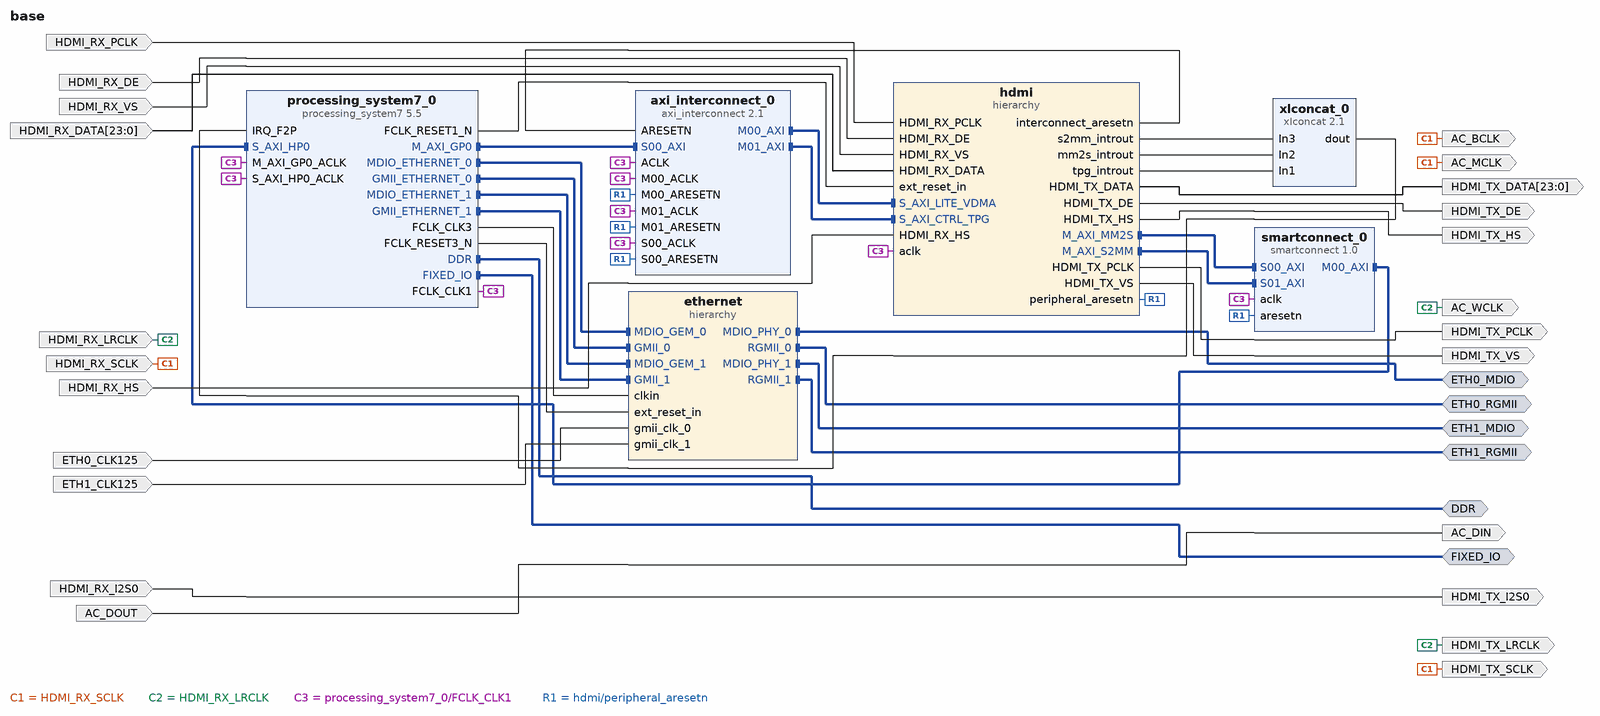
[diagram p0: block diagram of the top level]
# Vivado block design base, xc7z020clg400-3, Vivado 2018.2
create_bd_design base

create_bd_intf_port -mode Master -vlnv xilinx.com:interface:ddrx_rtl:1.0 DDR
create_bd_intf_port -mode Master -vlnv xilinx.com:display_processing_system7:fixedio_rtl:1.0 FIXED_IO
create_bd_intf_port -mode Master -vlnv xilinx.com:interface:mdio_rtl:1.0 ETH0_MDIO
create_bd_intf_port -mode Master -vlnv xilinx.com:interface:rgmii_rtl:1.0 ETH0_RGMII
create_bd_intf_port -mode Master -vlnv xilinx.com:interface:mdio_rtl:1.0 ETH1_MDIO
create_bd_intf_port -mode Master -vlnv xilinx.com:interface:rgmii_rtl:1.0 ETH1_RGMII
create_bd_port -dir I -type clk HDMI_RX_PCLK
set_property -dict {CONFIG.FREQ_HZ 74250000} [get_bd_ports HDMI_RX_PCLK]
create_bd_port -dir I HDMI_RX_SCLK
create_bd_port -dir O HDMI_TX_SCLK
create_bd_port -dir O AC_MCLK
create_bd_port -dir O -type clk AC_BCLK
create_bd_port -dir I HDMI_RX_LRCLK
create_bd_port -dir O HDMI_TX_LRCLK
create_bd_port -dir O AC_WCLK
create_bd_port -dir I HDMI_RX_I2S0
create_bd_port -dir O -type data HDMI_TX_I2S0
create_bd_port -dir I -type data AC_DOUT
create_bd_port -dir O -type data AC_DIN
create_bd_port -dir O -from 23 -to 0 HDMI_TX_DATA
create_bd_port -dir O HDMI_TX_DE
create_bd_port -dir O HDMI_TX_HS
create_bd_port -dir O HDMI_TX_VS
create_bd_port -dir I HDMI_RX_DE
create_bd_port -dir I HDMI_RX_VS
create_bd_port -dir I -from 23 -to 0 -type data HDMI_RX_DATA
create_bd_port -dir I HDMI_RX_HS
create_bd_port -dir I -type clk ETH0_CLK125
set_property -dict {CONFIG.FREQ_HZ 125000000} [get_bd_ports ETH0_CLK125]
create_bd_port -dir I -type clk ETH1_CLK125
set_property -dict {CONFIG.FREQ_HZ 125000000} [get_bd_ports ETH1_CLK125]
create_bd_port -dir O -type clk HDMI_TX_PCLK

create_bd_cell -type ip -vlnv xilinx.com:ip:xlconcat:2.1 xlconcat_0
set_property -dict {CONFIG.NUM_PORTS 4 CONFIG.IN0_WIDTH 13} [get_bd_cells xlconcat_0]
create_bd_cell -type ip -vlnv xilinx.com:ip:processing_system7:5.5 processing_system7_0
set_property -dict [list \
  CONFIG.PCW_UIPARAM_DDR_FREQ_MHZ 400 \
  CONFIG.PCW_CPU_CPU_6X4X_MAX_RANGE 867 \
  CONFIG.PCW_CRYSTAL_PERIPHERAL_FREQMHZ 33.333 \
  CONFIG.PCW_APU_PERIPHERAL_FREQMHZ 867 \
  CONFIG.PCW_SDIO_PERIPHERAL_FREQMHZ 100 \
  CONFIG.PCW_UART_PERIPHERAL_FREQMHZ 50 \
  CONFIG.PCW_I2C_PERIPHERAL_FREQMHZ 144.442993 \
  CONFIG.PCW_FPGA0_PERIPHERAL_FREQMHZ 50 \
  CONFIG.PCW_FPGA1_PERIPHERAL_FREQMHZ 100 \
  CONFIG.PCW_FPGA2_PERIPHERAL_FREQMHZ 150 \
  CONFIG.PCW_FPGA3_PERIPHERAL_FREQMHZ 200 \
  CONFIG.PCW_USE_S_AXI_HP0 1 \
  CONFIG.PCW_USE_FABRIC_INTERRUPT 1 \
  CONFIG.PCW_S_AXI_HP0_DATA_WIDTH 32 \
  CONFIG.PCW_EN_CLK1_PORT 1 \
  CONFIG.PCW_EN_CLK2_PORT 1 \
  CONFIG.PCW_EN_CLK3_PORT 1 \
  CONFIG.PCW_EN_RST1_PORT 1 \
  CONFIG.PCW_EN_RST2_PORT 1 \
  CONFIG.PCW_EN_RST3_PORT 1 \
  CONFIG.PCW_IRQ_F2P_INTR 1 \
  CONFIG.PCW_PERIPHERAL_BOARD_PRESET part0 \
  CONFIG.PCW_PRESET_BANK0_VOLTAGE {LVCMOS 1.8V} \
  CONFIG.PCW_PRESET_BANK1_VOLTAGE {LVCMOS 1.8V} \
  CONFIG.PCW_UIPARAM_DDR_MEMORY_TYPE {LPDDR 2} \
  CONFIG.PCW_UIPARAM_DDR_PARTNO Custom \
  CONFIG.PCW_QSPI_PERIPHERAL_ENABLE 1 \
  CONFIG.PCW_QSPI_QSPI_IO {MIO 1 .. 6} \
  CONFIG.PCW_QSPI_GRP_SINGLE_SS_ENABLE 1 \
  CONFIG.PCW_QSPI_GRP_SINGLE_SS_IO {MIO 1 .. 6} \
  CONFIG.PCW_SINGLE_QSPI_DATA_MODE x4 \
  CONFIG.PCW_QSPI_GRP_FBCLK_ENABLE 1 \
  CONFIG.PCW_QSPI_GRP_FBCLK_IO {MIO 8} \
  CONFIG.PCW_ENET0_PERIPHERAL_ENABLE 1 \
  CONFIG.PCW_ENET0_ENET0_IO EMIO \
  CONFIG.PCW_ENET0_GRP_MDIO_ENABLE 1 \
  CONFIG.PCW_ENET0_GRP_MDIO_IO EMIO \
  CONFIG.PCW_ENET_RESET_ENABLE 1 \
  CONFIG.PCW_ENET_RESET_SELECT {Share reset pin} \
  CONFIG.PCW_ENET0_RESET_ENABLE 0 \
  CONFIG.PCW_ENET1_PERIPHERAL_ENABLE 1 \
  CONFIG.PCW_ENET1_ENET1_IO EMIO \
  CONFIG.PCW_ENET1_GRP_MDIO_ENABLE 1 \
  CONFIG.PCW_ENET1_GRP_MDIO_IO EMIO \
  CONFIG.PCW_SD0_PERIPHERAL_ENABLE 1 \
  CONFIG.PCW_SD0_SD0_IO {MIO 40 .. 45} \
  CONFIG.PCW_SD0_GRP_CD_ENABLE 0 \
  CONFIG.PCW_SD0_GRP_WP_ENABLE 0 \
  CONFIG.PCW_SD1_PERIPHERAL_ENABLE 1 \
  CONFIG.PCW_SD1_SD1_IO {MIO 10 .. 15} \
  CONFIG.PCW_UART0_PERIPHERAL_ENABLE 1 \
  CONFIG.PCW_UART0_UART0_IO {MIO 50 .. 51} \
  CONFIG.PCW_UART1_PERIPHERAL_ENABLE 0 \
  CONFIG.PCW_SPI1_PERIPHERAL_ENABLE 1 \
  CONFIG.PCW_SPI1_SPI1_IO {MIO 46 .. 51} \
  CONFIG.PCW_USB0_PERIPHERAL_ENABLE 1 \
  CONFIG.PCW_USB0_USB0_IO {MIO 28 .. 39} \
  CONFIG.PCW_USB_RESET_ENABLE 1 \
  CONFIG.PCW_USB_RESET_SELECT {Share reset pin} \
  CONFIG.PCW_USB0_RESET_ENABLE 0 \
  CONFIG.PCW_I2C1_PERIPHERAL_ENABLE 1 \
  CONFIG.PCW_I2C1_I2C1_IO {MIO 24 .. 25} \
  CONFIG.PCW_I2C_RESET_ENABLE 1 \
  CONFIG.PCW_I2C_RESET_SELECT {Share reset pin} \
  CONFIG.PCW_GPIO_PERIPHERAL_ENABLE 1 \
  CONFIG.PCW_GPIO_MIO_GPIO_ENABLE 1 \
  CONFIG.PCW_GPIO_MIO_GPIO_IO MIO \
  CONFIG.PCW_GPIO_EMIO_GPIO_ENABLE 1 \
  CONFIG.PCW_GPIO_EMIO_GPIO_IO 64 \
  CONFIG.PCW_FPGA_FCLK1_ENABLE 1 \
  CONFIG.PCW_FPGA_FCLK2_ENABLE 1 \
  CONFIG.PCW_FPGA_FCLK3_ENABLE 1 \
] [get_bd_cells processing_system7_0]
# 527 more settings of processing_system7_0 are not shown: defaults, MIO pin electricals, DDR timing, and values the tool derives
create_bd_cell -type hier hdmi
create_bd_cell -type hier ethernet
create_bd_cell -type ip -vlnv xilinx.com:ip:axi_interconnect:2.1 axi_interconnect_0
set_property -dict {CONFIG.NUM_MI 2} [get_bd_cells axi_interconnect_0]
create_bd_cell -type ip -vlnv xilinx.com:ip:smartconnect:1.0 smartconnect_0

# ---- hierarchy /hdmi ----
current_bd_instance /hdmi
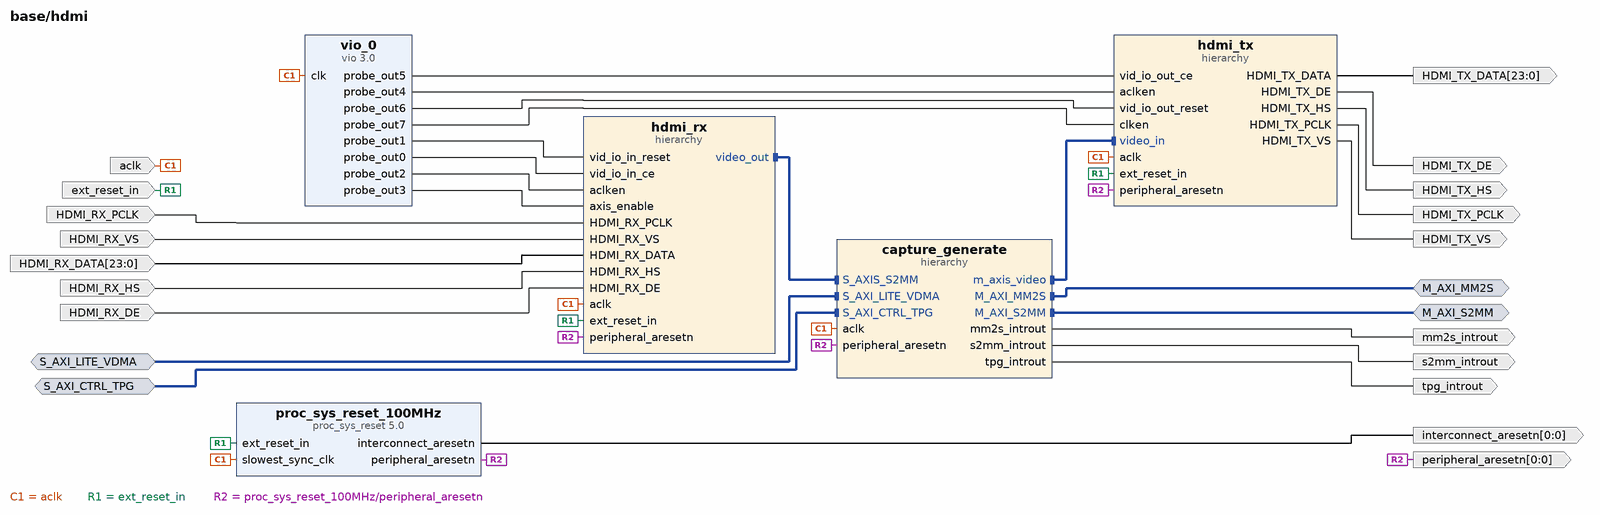
[diagram p1: block diagram inside /hdmi]
create_bd_intf_pin -mode Slave -vlnv xilinx.com:interface:aximm_rtl:1.0 S_AXI_LITE_VDMA
create_bd_intf_pin -mode Master -vlnv xilinx.com:interface:aximm_rtl:1.0 M_AXI_MM2S
create_bd_intf_pin -mode Master -vlnv xilinx.com:interface:aximm_rtl:1.0 M_AXI_S2MM
create_bd_intf_pin -mode Slave -vlnv xilinx.com:interface:aximm_rtl:1.0 S_AXI_CTRL_TPG
create_bd_pin -dir I -type clk aclk
create_bd_pin -dir I -type rst ext_reset_in
create_bd_pin -dir I -type clk HDMI_RX_PCLK
create_bd_pin -dir O -from 23 -to 0 HDMI_TX_DATA
create_bd_pin -dir O HDMI_TX_DE
create_bd_pin -dir O HDMI_TX_HS
create_bd_pin -dir O HDMI_TX_VS
create_bd_pin -dir I HDMI_RX_DE
create_bd_pin -dir I HDMI_RX_VS
create_bd_pin -dir I -from 23 -to 0 HDMI_RX_DATA
create_bd_pin -dir I HDMI_RX_HS
create_bd_pin -dir O -from 0 -to 0 -type rst peripheral_aresetn
create_bd_pin -dir O -from 0 -to 0 -type rst interconnect_aresetn
create_bd_pin -dir O -type intr mm2s_introut
create_bd_pin -dir O -type intr s2mm_introut
create_bd_pin -dir O HDMI_TX_PCLK
create_bd_pin -dir O -type intr tpg_introut

create_bd_cell -type ip -vlnv xilinx.com:ip:proc_sys_reset:5.0 proc_sys_reset_100MHz
create_bd_cell -type hier hdmi_rx
create_bd_cell -type hier hdmi_tx
create_bd_cell -type hier capture_generate
create_bd_cell -type ip -vlnv xilinx.com:ip:vio:3.0 vio_0
set_property -dict [list \
  CONFIG.C_PROBE_OUT7_INIT_VAL 0x1 \
  CONFIG.C_PROBE_OUT5_INIT_VAL 0x1 \
  CONFIG.C_PROBE_OUT4_INIT_VAL 0x1 \
  CONFIG.C_PROBE_OUT3_INIT_VAL 0x1 \
  CONFIG.C_PROBE_OUT2_INIT_VAL 0x1 \
  CONFIG.C_PROBE_OUT0_INIT_VAL 0x1 \
  CONFIG.C_NUM_PROBE_OUT 8 \
  CONFIG.C_NUM_PROBE_IN 0 \
] [get_bd_cells vio_0]

# ---- hierarchy /hdmi/hdmi_rx ----
current_bd_instance /hdmi/hdmi_rx
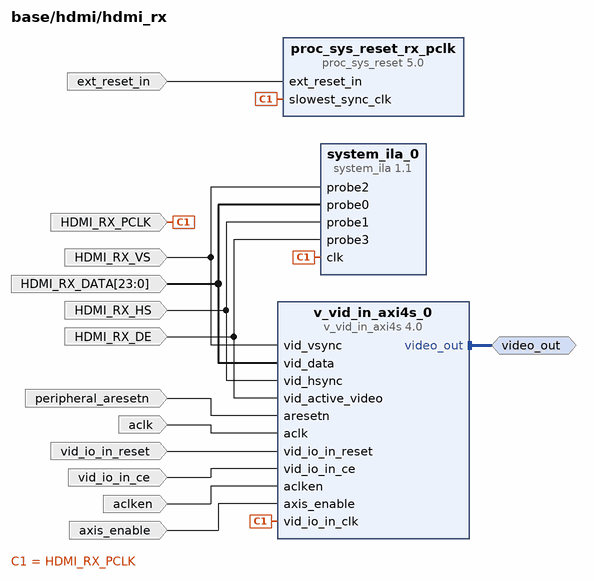
[diagram p2: block diagram inside /hdmi/hdmi_rx]
create_bd_intf_pin -mode Master -vlnv xilinx.com:interface:axis_rtl:1.0 video_out
create_bd_pin -dir I -type rst peripheral_aresetn
create_bd_pin -dir I HDMI_RX_VS
create_bd_pin -dir I -from 23 -to 0 HDMI_RX_DATA
create_bd_pin -dir I HDMI_RX_HS
create_bd_pin -dir I -type clk HDMI_RX_PCLK
create_bd_pin -dir I HDMI_RX_DE
create_bd_pin -dir I -type clk aclk
create_bd_pin -dir I -type rst vid_io_in_reset
create_bd_pin -dir I -type ce vid_io_in_ce
create_bd_pin -dir I -type ce aclken
create_bd_pin -dir I axis_enable
create_bd_pin -dir I -type rst ext_reset_in

create_bd_cell -type ip -vlnv xilinx.com:ip:v_vid_in_axi4s:4.0 v_vid_in_axi4s_0
set_property -dict {CONFIG.C_HAS_ASYNC_CLK 1 CONFIG.C_ADDR_WIDTH 12} [get_bd_cells v_vid_in_axi4s_0]
create_bd_cell -type ip -vlnv xilinx.com:ip:proc_sys_reset:5.0 proc_sys_reset_rx_pclk
create_bd_cell -type ip -vlnv xilinx.com:ip:system_ila:1.1 system_ila_0
set_property -dict [list \
  CONFIG.C_PROBE0_TYPE 1 \
  CONFIG.C_PROBE0_WIDTH 24 \
  CONFIG.C_DATA_DEPTH 4096 \
  CONFIG.C_NUM_OF_PROBES 4 \
  CONFIG.C_MON_TYPE NATIVE \
  CONFIG.C_PROBE_WIDTH_PROPAGATION MANUAL \
] [get_bd_cells system_ila_0]

# ---- hierarchy /hdmi/hdmi_tx ----
current_bd_instance /hdmi/hdmi_tx
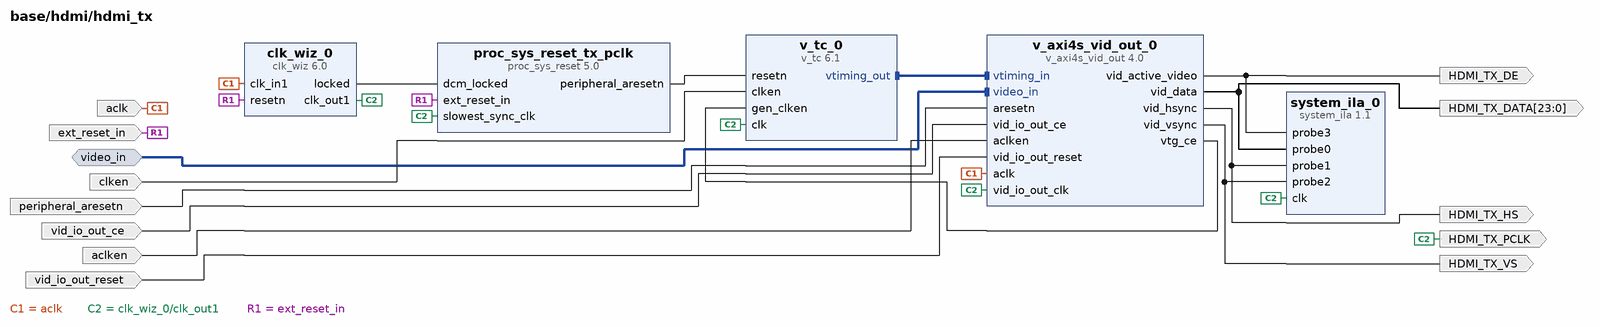
[diagram p3: block diagram inside /hdmi/hdmi_tx]
create_bd_intf_pin -mode Slave -vlnv xilinx.com:interface:axis_rtl:1.0 video_in
create_bd_pin -dir I -type rst peripheral_aresetn
create_bd_pin -dir O HDMI_TX_DE
create_bd_pin -dir O HDMI_TX_HS
create_bd_pin -dir O HDMI_TX_VS
create_bd_pin -dir O -from 23 -to 0 HDMI_TX_DATA
create_bd_pin -dir I -type clk aclk
create_bd_pin -dir I -type ce vid_io_out_ce
create_bd_pin -dir I -type ce aclken
create_bd_pin -dir I -type rst vid_io_out_reset
create_bd_pin -dir I -type ce clken
create_bd_pin -dir I -type rst ext_reset_in
create_bd_pin -dir O -type clk HDMI_TX_PCLK

create_bd_cell -type ip -vlnv xilinx.com:ip:v_axi4s_vid_out:4.0 v_axi4s_vid_out_0
set_property -dict {CONFIG.C_HAS_ASYNC_CLK 1 CONFIG.C_ADDR_WIDTH 5 CONFIG.C_VTG_MASTER_SLAVE 0} [get_bd_cells v_axi4s_vid_out_0]
create_bd_cell -type ip -vlnv xilinx.com:ip:v_tc:6.1 v_tc_0
set_property -dict [list \
  CONFIG.HAS_AXI4_LITE false \
  CONFIG.enable_detection false \
  CONFIG.vertical_blank_generation true \
  CONFIG.horizontal_blank_generation true \
] [get_bd_cells v_tc_0]
create_bd_cell -type ip -vlnv xilinx.com:ip:proc_sys_reset:5.0 proc_sys_reset_tx_pclk
create_bd_cell -type ip -vlnv xilinx.com:ip:clk_wiz:6.0 clk_wiz_0
set_property -dict [list \
  CONFIG.CLKOUT1_REQUESTED_OUT_FREQ 74.25 \
  CONFIG.PRIM_SOURCE No_buffer \
  CONFIG.RESET_PORT resetn \
  CONFIG.MMCM_DIVCLK_DIVIDE 2 \
  CONFIG.MMCM_CLKFBOUT_MULT_F 24.875 \
  CONFIG.MMCM_CLKOUT0_DIVIDE_F 16.750 \
  CONFIG.RESET_TYPE ACTIVE_LOW \
  CONFIG.CLKOUT1_JITTER 138.109 \
  CONFIG.CLKOUT1_PHASE_ERROR 148.904 \
] [get_bd_cells clk_wiz_0]
create_bd_cell -type ip -vlnv xilinx.com:ip:system_ila:1.1 system_ila_0
set_property -dict [list \
  CONFIG.C_PROBE0_TYPE 1 \
  CONFIG.C_PROBE0_WIDTH 24 \
  CONFIG.C_DATA_DEPTH 4096 \
  CONFIG.C_NUM_OF_PROBES 4 \
  CONFIG.C_MON_TYPE NATIVE \
  CONFIG.C_PROBE_WIDTH_PROPAGATION MANUAL \
] [get_bd_cells system_ila_0]

# ---- hierarchy /hdmi/capture_generate ----
current_bd_instance /hdmi/capture_generate
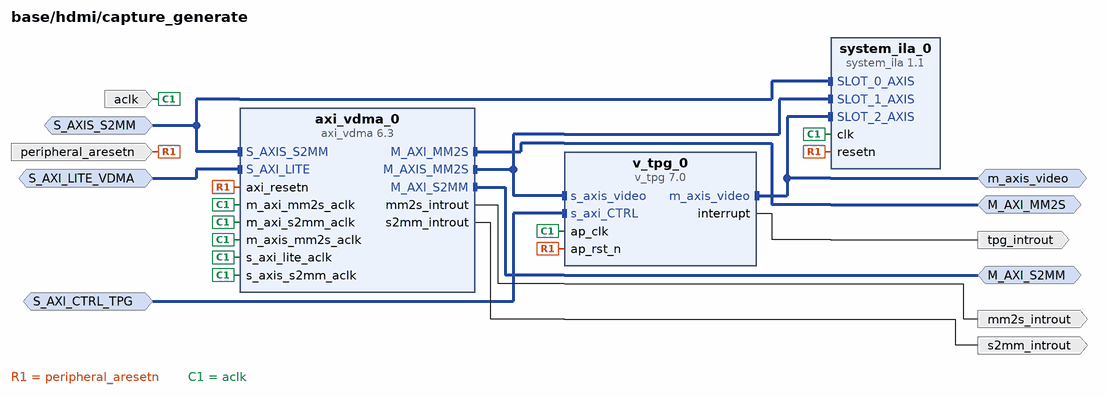
[diagram p4: block diagram inside /hdmi/capture_generate]
create_bd_intf_pin -mode Slave -vlnv xilinx.com:interface:aximm_rtl:1.0 S_AXI_LITE_VDMA
create_bd_intf_pin -mode Master -vlnv xilinx.com:interface:aximm_rtl:1.0 M_AXI_MM2S
create_bd_intf_pin -mode Master -vlnv xilinx.com:interface:aximm_rtl:1.0 M_AXI_S2MM
create_bd_intf_pin -mode Slave -vlnv xilinx.com:interface:axis_rtl:1.0 S_AXIS_S2MM
create_bd_intf_pin -mode Slave -vlnv xilinx.com:interface:aximm_rtl:1.0 S_AXI_CTRL_TPG
create_bd_intf_pin -mode Master -vlnv xilinx.com:interface:axis_rtl:1.0 m_axis_video
create_bd_pin -dir I -type rst peripheral_aresetn
create_bd_pin -dir O -type intr mm2s_introut
create_bd_pin -dir O -type intr s2mm_introut
create_bd_pin -dir I -type clk aclk
create_bd_pin -dir O -type intr tpg_introut

create_bd_cell -type ip -vlnv xilinx.com:ip:axi_vdma:6.3 axi_vdma_0
set_property -dict [list \
  CONFIG.c_m_axi_mm2s_data_width 32 \
  CONFIG.c_m_axis_mm2s_tdata_width 24 \
  CONFIG.c_m_axi_s2mm_data_width 32 \
  CONFIG.c_mm2s_genlock_mode 2 \
  CONFIG.c_s2mm_genlock_mode 3 \
  CONFIG.c_s2mm_linebuffer_depth 512 \
  CONFIG.c_mm2s_max_burst_length 8 \
] [get_bd_cells axi_vdma_0]
create_bd_cell -type ip -vlnv xilinx.com:ip:system_ila:1.1 system_ila_0
set_property -dict [list \
  CONFIG.C_SLOT 2 \
  CONFIG.C_DATA_DEPTH 4096 \
  CONFIG.C_NUM_OF_PROBES 1 \
  CONFIG.C_NUM_MONITOR_SLOTS 3 \
  CONFIG.C_SLOT_0_INTF_TYPE xilinx.com:interface:axis_rtl:1.0 \
  CONFIG.C_SLOT_1_INTF_TYPE xilinx.com:interface:axis_rtl:1.0 \
  CONFIG.C_SLOT_2_INTF_TYPE xilinx.com:interface:axis_rtl:1.0 \
  CONFIG.C_MON_TYPE INTERFACE \
  CONFIG.C_PROBE_WIDTH_PROPAGATION AUTO \
] [get_bd_cells system_ila_0]
create_bd_cell -type ip -vlnv xilinx.com:ip:v_tpg:7.0 v_tpg_0
set_property -dict {CONFIG.HAS_AXI4S_SLAVE 1} [get_bd_cells v_tpg_0]

# ---- hierarchy /ethernet ----
current_bd_instance /ethernet
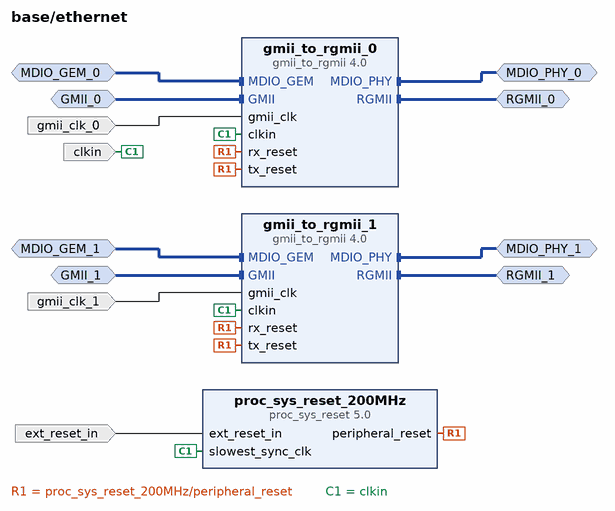
[diagram p5: block diagram inside /ethernet]
create_bd_intf_pin -mode Master -vlnv xilinx.com:interface:mdio_rtl:1.0 MDIO_PHY_0
create_bd_intf_pin -mode Master -vlnv xilinx.com:interface:rgmii_rtl:1.0 RGMII_0
create_bd_intf_pin -mode Slave -vlnv xilinx.com:interface:mdio_rtl:1.0 MDIO_GEM_0
create_bd_intf_pin -mode Slave -vlnv xilinx.com:interface:gmii_rtl:1.0 GMII_0
create_bd_intf_pin -mode Master -vlnv xilinx.com:interface:mdio_rtl:1.0 MDIO_PHY_1
create_bd_intf_pin -mode Master -vlnv xilinx.com:interface:rgmii_rtl:1.0 RGMII_1
create_bd_intf_pin -mode Slave -vlnv xilinx.com:interface:mdio_rtl:1.0 MDIO_GEM_1
create_bd_intf_pin -mode Slave -vlnv xilinx.com:interface:gmii_rtl:1.0 GMII_1
create_bd_pin -dir I -type clk gmii_clk_0
create_bd_pin -dir I -type clk clkin
create_bd_pin -dir I -type clk gmii_clk_1
create_bd_pin -dir I -type rst ext_reset_in

create_bd_cell -type ip -vlnv xilinx.com:ip:gmii_to_rgmii:4.0 gmii_to_rgmii_0
set_property -dict [list \
  CONFIG.C_EXTERNAL_CLOCK true \
  CONFIG.C_USE_IDELAY_CTRL true \
  CONFIG.RGMII_TXC_SKEW 0 \
  CONFIG.SupportLevel Include_Shared_Logic_in_Core \
] [get_bd_cells gmii_to_rgmii_0]
create_bd_cell -type ip -vlnv xilinx.com:ip:gmii_to_rgmii:4.0 gmii_to_rgmii_1
set_property -dict [list \
  CONFIG.C_EXTERNAL_CLOCK true \
  CONFIG.C_PHYADDR 9 \
  CONFIG.SupportLevel Include_Shared_Logic_in_Core \
] [get_bd_cells gmii_to_rgmii_1]
create_bd_cell -type ip -vlnv xilinx.com:ip:proc_sys_reset:5.0 proc_sys_reset_200MHz

# ---- connections ----

current_bd_instance /hdmi
connect_bd_intf_net -intf_net v_vid_in_axi4s_0_video_out [get_bd_intf_pins capture_generate/S_AXIS_S2MM] [get_bd_intf_pins hdmi_rx/video_out]
connect_bd_intf_net [get_bd_intf_pins hdmi_tx/video_in] [get_bd_intf_pins capture_generate/m_axis_video]
connect_bd_intf_net [get_bd_intf_pins S_AXI_LITE_VDMA] [get_bd_intf_pins capture_generate/S_AXI_LITE_VDMA]
connect_bd_intf_net [get_bd_intf_pins M_AXI_MM2S] [get_bd_intf_pins capture_generate/M_AXI_MM2S]
connect_bd_intf_net [get_bd_intf_pins M_AXI_S2MM] [get_bd_intf_pins capture_generate/M_AXI_S2MM]
connect_bd_intf_net [get_bd_intf_pins S_AXI_CTRL_TPG] [get_bd_intf_pins capture_generate/S_AXI_CTRL_TPG]
connect_bd_net -net slowest_sync_clk_1 [get_bd_pins aclk] \
  [get_bd_pins proc_sys_reset_100MHz/slowest_sync_clk] [get_bd_pins hdmi_rx/aclk] [get_bd_pins hdmi_tx/aclk] \
  [get_bd_pins capture_generate/aclk] [get_bd_pins vio_0/clk]
connect_bd_net [get_bd_pins ext_reset_in] \
  [get_bd_pins proc_sys_reset_100MHz/ext_reset_in] [get_bd_pins hdmi_rx/ext_reset_in] [get_bd_pins hdmi_tx/ext_reset_in]
connect_bd_net [get_bd_pins HDMI_RX_PCLK] [get_bd_pins hdmi_rx/HDMI_RX_PCLK]
connect_bd_net [get_bd_pins proc_sys_reset_100MHz/peripheral_aresetn] \
  [get_bd_pins peripheral_aresetn] [get_bd_pins hdmi_rx/peripheral_aresetn] [get_bd_pins hdmi_tx/peripheral_aresetn] \
  [get_bd_pins capture_generate/peripheral_aresetn]
connect_bd_net [get_bd_pins proc_sys_reset_100MHz/interconnect_aresetn] [get_bd_pins interconnect_aresetn]
connect_bd_net -net clk_wiz_0_clk_out1 [get_bd_pins hdmi_tx/HDMI_TX_PCLK] [get_bd_pins HDMI_TX_PCLK]
connect_bd_net [get_bd_pins HDMI_RX_VS] [get_bd_pins hdmi_rx/HDMI_RX_VS]
connect_bd_net [get_bd_pins HDMI_RX_DATA] [get_bd_pins hdmi_rx/HDMI_RX_DATA]
connect_bd_net [get_bd_pins HDMI_RX_HS] [get_bd_pins hdmi_rx/HDMI_RX_HS]
connect_bd_net [get_bd_pins HDMI_RX_DE] [get_bd_pins hdmi_rx/HDMI_RX_DE]
connect_bd_net [get_bd_pins vio_0/probe_out1] [get_bd_pins hdmi_rx/vid_io_in_reset]
connect_bd_net [get_bd_pins vio_0/probe_out0] [get_bd_pins hdmi_rx/vid_io_in_ce]
connect_bd_net [get_bd_pins vio_0/probe_out2] [get_bd_pins hdmi_rx/aclken]
connect_bd_net [get_bd_pins vio_0/probe_out3] [get_bd_pins hdmi_rx/axis_enable]
connect_bd_net [get_bd_pins hdmi_tx/HDMI_TX_DE] [get_bd_pins HDMI_TX_DE]
connect_bd_net [get_bd_pins hdmi_tx/HDMI_TX_HS] [get_bd_pins HDMI_TX_HS]
connect_bd_net [get_bd_pins hdmi_tx/HDMI_TX_VS] [get_bd_pins HDMI_TX_VS]
connect_bd_net [get_bd_pins hdmi_tx/HDMI_TX_DATA] [get_bd_pins HDMI_TX_DATA]
connect_bd_net [get_bd_pins vio_0/probe_out5] [get_bd_pins hdmi_tx/vid_io_out_ce]
connect_bd_net [get_bd_pins vio_0/probe_out4] [get_bd_pins hdmi_tx/aclken]
connect_bd_net [get_bd_pins vio_0/probe_out6] [get_bd_pins hdmi_tx/vid_io_out_reset]
connect_bd_net [get_bd_pins vio_0/probe_out7] [get_bd_pins hdmi_tx/clken]
connect_bd_net [get_bd_pins capture_generate/mm2s_introut] [get_bd_pins mm2s_introut]
connect_bd_net [get_bd_pins capture_generate/s2mm_introut] [get_bd_pins s2mm_introut]
connect_bd_net [get_bd_pins capture_generate/tpg_introut] [get_bd_pins tpg_introut]

current_bd_instance /hdmi/hdmi_rx
connect_bd_intf_net [get_bd_intf_pins video_out] [get_bd_intf_pins v_vid_in_axi4s_0/video_out]
connect_bd_net [get_bd_pins peripheral_aresetn] [get_bd_pins v_vid_in_axi4s_0/aresetn]
connect_bd_net [get_bd_pins HDMI_RX_VS] [get_bd_pins v_vid_in_axi4s_0/vid_vsync] [get_bd_pins system_ila_0/probe2]
connect_bd_net [get_bd_pins HDMI_RX_DATA] [get_bd_pins v_vid_in_axi4s_0/vid_data] [get_bd_pins system_ila_0/probe0]
connect_bd_net [get_bd_pins HDMI_RX_HS] [get_bd_pins v_vid_in_axi4s_0/vid_hsync] [get_bd_pins system_ila_0/probe1]
connect_bd_net [get_bd_pins HDMI_RX_PCLK] \
  [get_bd_pins v_vid_in_axi4s_0/vid_io_in_clk] [get_bd_pins proc_sys_reset_rx_pclk/slowest_sync_clk] \
  [get_bd_pins system_ila_0/clk]
connect_bd_net [get_bd_pins HDMI_RX_DE] [get_bd_pins v_vid_in_axi4s_0/vid_active_video] [get_bd_pins system_ila_0/probe3]
connect_bd_net [get_bd_pins aclk] [get_bd_pins v_vid_in_axi4s_0/aclk]
connect_bd_net [get_bd_pins vid_io_in_reset] [get_bd_pins v_vid_in_axi4s_0/vid_io_in_reset]
connect_bd_net [get_bd_pins vid_io_in_ce] [get_bd_pins v_vid_in_axi4s_0/vid_io_in_ce]
connect_bd_net [get_bd_pins aclken] [get_bd_pins v_vid_in_axi4s_0/aclken]
connect_bd_net [get_bd_pins axis_enable] [get_bd_pins v_vid_in_axi4s_0/axis_enable]
connect_bd_net [get_bd_pins ext_reset_in] [get_bd_pins proc_sys_reset_rx_pclk/ext_reset_in]

current_bd_instance /hdmi/hdmi_tx
connect_bd_intf_net [get_bd_intf_pins v_axi4s_vid_out_0/vtiming_in] [get_bd_intf_pins v_tc_0/vtiming_out]
connect_bd_intf_net [get_bd_intf_pins video_in] [get_bd_intf_pins v_axi4s_vid_out_0/video_in]
connect_bd_net [get_bd_pins peripheral_aresetn] [get_bd_pins v_axi4s_vid_out_0/aresetn]
connect_bd_net [get_bd_pins v_axi4s_vid_out_0/vid_active_video] [get_bd_pins HDMI_TX_DE] [get_bd_pins system_ila_0/probe3]
connect_bd_net [get_bd_pins v_axi4s_vid_out_0/vid_hsync] [get_bd_pins HDMI_TX_HS] [get_bd_pins system_ila_0/probe1]
connect_bd_net [get_bd_pins v_axi4s_vid_out_0/vid_vsync] [get_bd_pins HDMI_TX_VS] [get_bd_pins system_ila_0/probe2]
connect_bd_net [get_bd_pins v_axi4s_vid_out_0/vid_data] [get_bd_pins HDMI_TX_DATA] [get_bd_pins system_ila_0/probe0]
connect_bd_net [get_bd_pins aclk] [get_bd_pins v_axi4s_vid_out_0/aclk] [get_bd_pins clk_wiz_0/clk_in1]
connect_bd_net [get_bd_pins vid_io_out_ce] [get_bd_pins v_axi4s_vid_out_0/vid_io_out_ce]
connect_bd_net [get_bd_pins aclken] [get_bd_pins v_axi4s_vid_out_0/aclken]
connect_bd_net [get_bd_pins vid_io_out_reset] [get_bd_pins v_axi4s_vid_out_0/vid_io_out_reset]
connect_bd_net -net HDMI_TX_PCLK_1 [get_bd_pins clk_wiz_0/clk_out1] \
  [get_bd_pins HDMI_TX_PCLK] [get_bd_pins v_axi4s_vid_out_0/vid_io_out_clk] [get_bd_pins v_tc_0/clk] \
  [get_bd_pins proc_sys_reset_tx_pclk/slowest_sync_clk] [get_bd_pins system_ila_0/clk]
connect_bd_net [get_bd_pins v_axi4s_vid_out_0/vtg_ce] [get_bd_pins v_tc_0/gen_clken]
connect_bd_net [get_bd_pins clken] [get_bd_pins v_tc_0/clken]
connect_bd_net [get_bd_pins proc_sys_reset_tx_pclk/peripheral_aresetn] [get_bd_pins v_tc_0/resetn]
connect_bd_net [get_bd_pins ext_reset_in] [get_bd_pins proc_sys_reset_tx_pclk/ext_reset_in] [get_bd_pins clk_wiz_0/resetn]
connect_bd_net [get_bd_pins clk_wiz_0/locked] [get_bd_pins proc_sys_reset_tx_pclk/dcm_locked]

current_bd_instance /hdmi/capture_generate
connect_bd_intf_net [get_bd_intf_pins axi_vdma_0/M_AXIS_MM2S] [get_bd_intf_pins v_tpg_0/s_axis_video]
connect_bd_intf_net [get_bd_intf_pins axi_vdma_0/M_AXIS_MM2S] [get_bd_intf_pins system_ila_0/SLOT_1_AXIS]
connect_bd_intf_net [get_bd_intf_pins S_AXI_LITE_VDMA] [get_bd_intf_pins axi_vdma_0/S_AXI_LITE]
connect_bd_intf_net [get_bd_intf_pins M_AXI_MM2S] [get_bd_intf_pins axi_vdma_0/M_AXI_MM2S]
connect_bd_intf_net [get_bd_intf_pins M_AXI_S2MM] [get_bd_intf_pins axi_vdma_0/M_AXI_S2MM]
connect_bd_intf_net [get_bd_intf_pins S_AXIS_S2MM] [get_bd_intf_pins axi_vdma_0/S_AXIS_S2MM]
connect_bd_intf_net [get_bd_intf_pins S_AXIS_S2MM] [get_bd_intf_pins system_ila_0/SLOT_0_AXIS]
connect_bd_intf_net [get_bd_intf_pins S_AXI_CTRL_TPG] [get_bd_intf_pins v_tpg_0/s_axi_CTRL]
connect_bd_intf_net [get_bd_intf_pins m_axis_video] [get_bd_intf_pins v_tpg_0/m_axis_video]
connect_bd_intf_net [get_bd_intf_pins m_axis_video] [get_bd_intf_pins system_ila_0/SLOT_2_AXIS]
connect_bd_net [get_bd_pins peripheral_aresetn] [get_bd_pins axi_vdma_0/axi_resetn] [get_bd_pins system_ila_0/resetn] [get_bd_pins v_tpg_0/ap_rst_n]
connect_bd_net [get_bd_pins axi_vdma_0/mm2s_introut] [get_bd_pins mm2s_introut]
connect_bd_net [get_bd_pins axi_vdma_0/s2mm_introut] [get_bd_pins s2mm_introut]
connect_bd_net [get_bd_pins aclk] \
  [get_bd_pins axi_vdma_0/s_axi_lite_aclk] [get_bd_pins axi_vdma_0/m_axi_mm2s_aclk] [get_bd_pins axi_vdma_0/m_axis_mm2s_aclk] \
  [get_bd_pins axi_vdma_0/m_axi_s2mm_aclk] [get_bd_pins axi_vdma_0/s_axis_s2mm_aclk] [get_bd_pins system_ila_0/clk] \
  [get_bd_pins v_tpg_0/ap_clk]
connect_bd_net [get_bd_pins v_tpg_0/interrupt] [get_bd_pins tpg_introut]

current_bd_instance /ethernet
connect_bd_intf_net [get_bd_intf_pins MDIO_PHY_0] [get_bd_intf_pins gmii_to_rgmii_0/MDIO_PHY]
connect_bd_intf_net [get_bd_intf_pins RGMII_0] [get_bd_intf_pins gmii_to_rgmii_0/RGMII]
connect_bd_intf_net [get_bd_intf_pins MDIO_GEM_0] [get_bd_intf_pins gmii_to_rgmii_0/MDIO_GEM]
connect_bd_intf_net [get_bd_intf_pins GMII_0] [get_bd_intf_pins gmii_to_rgmii_0/GMII]
connect_bd_intf_net [get_bd_intf_pins MDIO_PHY_1] [get_bd_intf_pins gmii_to_rgmii_1/MDIO_PHY]
connect_bd_intf_net [get_bd_intf_pins RGMII_1] [get_bd_intf_pins gmii_to_rgmii_1/RGMII]
connect_bd_intf_net [get_bd_intf_pins MDIO_GEM_1] [get_bd_intf_pins gmii_to_rgmii_1/MDIO_GEM]
connect_bd_intf_net [get_bd_intf_pins GMII_1] [get_bd_intf_pins gmii_to_rgmii_1/GMII]
connect_bd_net -net ETH0_CLK125_1 [get_bd_pins gmii_clk_0] [get_bd_pins gmii_to_rgmii_0/gmii_clk]
connect_bd_net -net rx_reset_1 [get_bd_pins proc_sys_reset_200MHz/peripheral_reset] \
  [get_bd_pins gmii_to_rgmii_0/rx_reset] [get_bd_pins gmii_to_rgmii_0/tx_reset] [get_bd_pins gmii_to_rgmii_1/rx_reset] \
  [get_bd_pins gmii_to_rgmii_1/tx_reset]
connect_bd_net [get_bd_pins clkin] \
  [get_bd_pins gmii_to_rgmii_0/clkin] [get_bd_pins gmii_to_rgmii_1/clkin] \
  [get_bd_pins proc_sys_reset_200MHz/slowest_sync_clk]
connect_bd_net -net ETH1_CLK125_1 [get_bd_pins gmii_clk_1] [get_bd_pins gmii_to_rgmii_1/gmii_clk]
connect_bd_net [get_bd_pins ext_reset_in] [get_bd_pins proc_sys_reset_200MHz/ext_reset_in]

current_bd_instance /
connect_bd_intf_net [get_bd_intf_pins processing_system7_0/MDIO_ETHERNET_0] [get_bd_intf_pins ethernet/MDIO_GEM_0]
connect_bd_intf_net [get_bd_intf_pins processing_system7_0/GMII_ETHERNET_0] [get_bd_intf_pins ethernet/GMII_0]
connect_bd_intf_net [get_bd_intf_pins processing_system7_0/MDIO_ETHERNET_1] [get_bd_intf_pins ethernet/MDIO_GEM_1]
connect_bd_intf_net [get_bd_intf_pins processing_system7_0/GMII_ETHERNET_1] [get_bd_intf_pins ethernet/GMII_1]
connect_bd_intf_net [get_bd_intf_pins processing_system7_0/M_AXI_GP0] [get_bd_intf_pins axi_interconnect_0/S00_AXI]
connect_bd_intf_net [get_bd_intf_pins axi_interconnect_0/M00_AXI] [get_bd_intf_pins hdmi/S_AXI_LITE_VDMA]
connect_bd_intf_net [get_bd_intf_pins smartconnect_0/M00_AXI] [get_bd_intf_pins processing_system7_0/S_AXI_HP0]
connect_bd_intf_net [get_bd_intf_pins smartconnect_0/S00_AXI] [get_bd_intf_pins hdmi/M_AXI_MM2S]
connect_bd_intf_net [get_bd_intf_pins hdmi/M_AXI_S2MM] [get_bd_intf_pins smartconnect_0/S01_AXI]
connect_bd_intf_net [get_bd_intf_pins axi_interconnect_0/M01_AXI] [get_bd_intf_pins hdmi/S_AXI_CTRL_TPG]
connect_bd_intf_net [get_bd_intf_ports DDR] [get_bd_intf_pins processing_system7_0/DDR]
connect_bd_intf_net [get_bd_intf_ports FIXED_IO] [get_bd_intf_pins processing_system7_0/FIXED_IO]
connect_bd_intf_net -intf_net ethernet_ETH0_MDIO [get_bd_intf_ports ETH0_MDIO] [get_bd_intf_pins ethernet/MDIO_PHY_0]
connect_bd_intf_net -intf_net ethernet_ETH0_RGMII [get_bd_intf_ports ETH0_RGMII] [get_bd_intf_pins ethernet/RGMII_0]
connect_bd_intf_net -intf_net ethernet_ETH1_MDIO [get_bd_intf_ports ETH1_MDIO] [get_bd_intf_pins ethernet/MDIO_PHY_1]
connect_bd_intf_net -intf_net ethernet_ETH1_RGMII [get_bd_intf_ports ETH1_RGMII] [get_bd_intf_pins ethernet/RGMII_1]
connect_bd_net [get_bd_pins processing_system7_0/FCLK_CLK3] [get_bd_pins ethernet/clkin]
connect_bd_net [get_bd_ports HDMI_RX_PCLK] [get_bd_pins hdmi/HDMI_RX_PCLK]
connect_bd_net [get_bd_pins xlconcat_0/dout] [get_bd_pins processing_system7_0/IRQ_F2P]
connect_bd_net [get_bd_ports HDMI_RX_SCLK] [get_bd_ports AC_BCLK] [get_bd_ports AC_MCLK] [get_bd_ports HDMI_TX_SCLK]
connect_bd_net [get_bd_ports HDMI_RX_LRCLK] [get_bd_ports AC_WCLK] [get_bd_ports HDMI_TX_LRCLK]
connect_bd_net -net HDMI_RX_I2S0_1 [get_bd_ports HDMI_RX_I2S0] [get_bd_ports HDMI_TX_I2S0]
connect_bd_net -net AC_DIN_1 [get_bd_ports AC_DOUT] [get_bd_ports AC_DIN]
connect_bd_net [get_bd_pins processing_system7_0/FCLK_CLK1] \
  [get_bd_pins processing_system7_0/M_AXI_GP0_ACLK] [get_bd_pins processing_system7_0/S_AXI_HP0_ACLK] [get_bd_pins hdmi/aclk] \
  [get_bd_pins axi_interconnect_0/ACLK] [get_bd_pins axi_interconnect_0/S00_ACLK] [get_bd_pins axi_interconnect_0/M00_ACLK] \
  [get_bd_pins axi_interconnect_0/M01_ACLK] [get_bd_pins smartconnect_0/aclk]
connect_bd_net [get_bd_pins processing_system7_0/FCLK_RESET1_N] [get_bd_pins hdmi/ext_reset_in]
connect_bd_net [get_bd_pins hdmi/HDMI_TX_DATA] [get_bd_ports HDMI_TX_DATA]
connect_bd_net [get_bd_pins hdmi/HDMI_TX_DE] [get_bd_ports HDMI_TX_DE]
connect_bd_net [get_bd_pins hdmi/HDMI_TX_HS] [get_bd_ports HDMI_TX_HS]
connect_bd_net [get_bd_pins hdmi/HDMI_TX_VS] [get_bd_ports HDMI_TX_VS]
connect_bd_net [get_bd_ports HDMI_RX_DE] [get_bd_pins hdmi/HDMI_RX_DE]
connect_bd_net [get_bd_ports HDMI_RX_VS] [get_bd_pins hdmi/HDMI_RX_VS]
connect_bd_net [get_bd_ports HDMI_RX_DATA] [get_bd_pins hdmi/HDMI_RX_DATA]
connect_bd_net [get_bd_ports HDMI_RX_HS] [get_bd_pins hdmi/HDMI_RX_HS]
connect_bd_net -net ETH0_CLK125_1 [get_bd_ports ETH0_CLK125] [get_bd_pins ethernet/gmii_clk_0]
connect_bd_net -net ETH1_CLK125_1 [get_bd_ports ETH1_CLK125] [get_bd_pins ethernet/gmii_clk_1]
connect_bd_net [get_bd_pins processing_system7_0/FCLK_RESET3_N] [get_bd_pins ethernet/ext_reset_in]
connect_bd_net -net S00_ARESETN_1 [get_bd_pins hdmi/peripheral_aresetn] \
  [get_bd_pins axi_interconnect_0/S00_ARESETN] [get_bd_pins axi_interconnect_0/M00_ARESETN] \
  [get_bd_pins axi_interconnect_0/M01_ARESETN] [get_bd_pins smartconnect_0/aresetn]
connect_bd_net -net ARESETN_1 [get_bd_pins hdmi/interconnect_aresetn] [get_bd_pins axi_interconnect_0/ARESETN]
connect_bd_net [get_bd_pins hdmi/HDMI_TX_PCLK] [get_bd_ports HDMI_TX_PCLK]
connect_bd_net [get_bd_pins hdmi/s2mm_introut] [get_bd_pins xlconcat_0/In3]
connect_bd_net [get_bd_pins hdmi/mm2s_introut] [get_bd_pins xlconcat_0/In2]
connect_bd_net [get_bd_pins hdmi/tpg_introut] [get_bd_pins xlconcat_0/In1]

# ---- address map ----
assign_bd_address -offset 0x00000000 -range 1G -target_address_space [get_bd_addr_spaces hdmi/capture_generate/axi_vdma_0/Data_MM2S] [get_bd_addr_segs processing_system7_0/S_AXI_HP0/HP0_DDR_LOWOCM]
exclude_bd_addr_seg -offset 0x43000000 -range 64K -target_address_space [get_bd_addr_spaces hdmi/capture_generate/axi_vdma_0/Data_MM2S] [get_bd_addr_segs hdmi/capture_generate/axi_vdma_0/S_AXI_LITE/Reg]
assign_bd_address -offset 0x00000000 -range 1G -target_address_space [get_bd_addr_spaces hdmi/capture_generate/axi_vdma_0/Data_S2MM] [get_bd_addr_segs processing_system7_0/S_AXI_HP0/HP0_DDR_LOWOCM]
exclude_bd_addr_seg -offset 0x43000000 -range 64K -target_address_space [get_bd_addr_spaces hdmi/capture_generate/axi_vdma_0/Data_S2MM] [get_bd_addr_segs hdmi/capture_generate/axi_vdma_0/S_AXI_LITE/Reg]
assign_bd_address -offset 0x43000000 -range 64K -target_address_space [get_bd_addr_spaces processing_system7_0/Data] [get_bd_addr_segs hdmi/capture_generate/axi_vdma_0/S_AXI_LITE/Reg]
assign_bd_address -offset 0x43C00000 -range 64K -target_address_space [get_bd_addr_spaces processing_system7_0/Data] [get_bd_addr_segs hdmi/capture_generate/v_tpg_0/s_axi_CTRL/Reg]

validate_bd_design
save_bd_design
